# EAGLE design starfire-core (EAGLE 9.2.2)
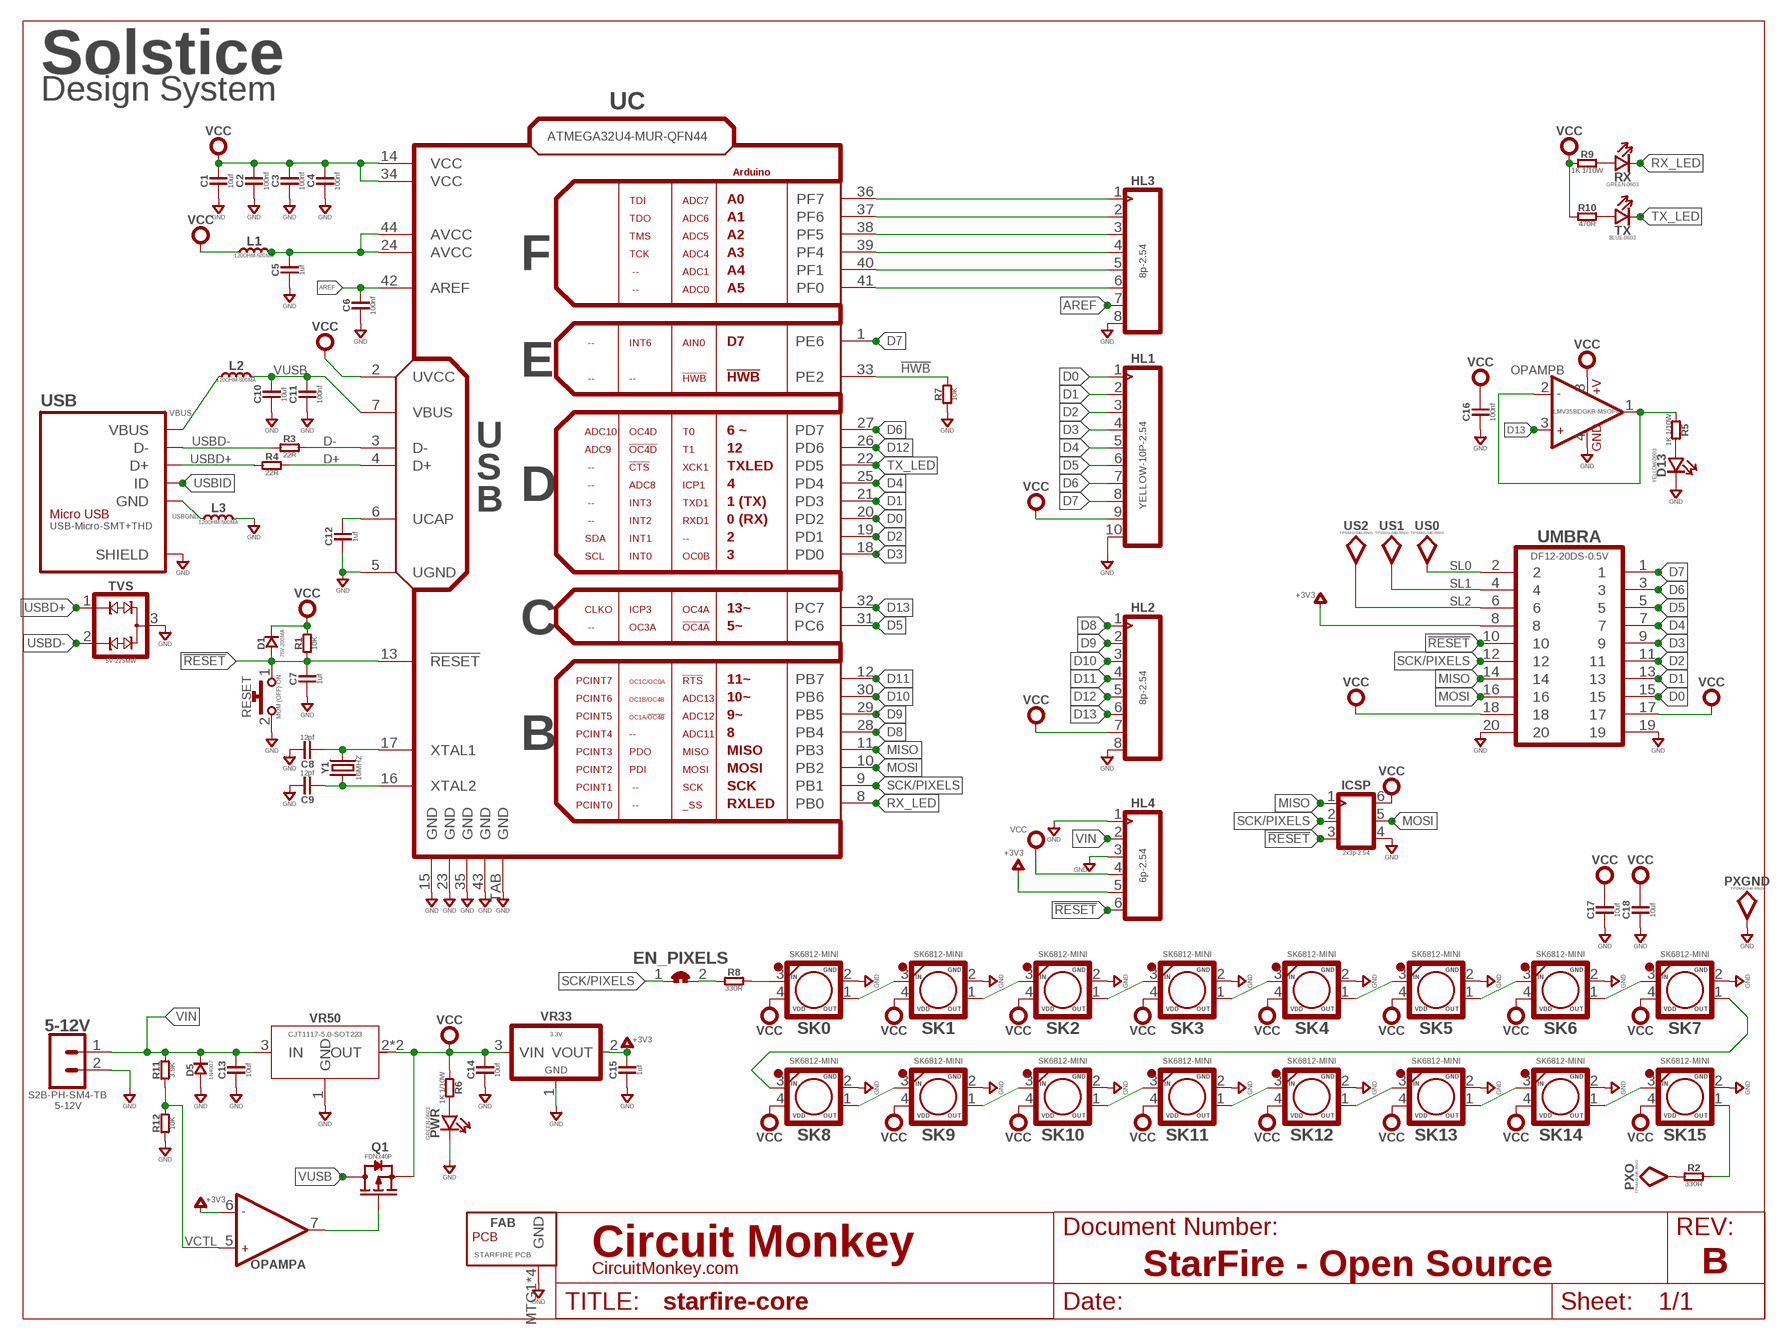
[diagram p0: schematic, sheet 1]
U$1 (LETTER_L-CIRCUITMONKEY): DOCUMENT_NUMBER: StarFire - Open Source; REV: B

## Parts
5-12V  S2B-PH-SM4-TB  02PRA-SMT  [S2B-PH-SM4-]
C1  10uf  CERAMIC-10UF-10V-10%-X5R(0603)  [C0603]
C2  100nf  CERAMIC-100NF-50V-10%-X7R(0603)  [C0603]
C3  100nf  CERAMIC-100NF-50V-10%-X7R(0603)  [C0603]
C4  100nf  CERAMIC-100NF-50V-10%-X7R(0603)  [C0603]
C5  1uf  CERAMIC-1UF-25V-10%-X7R(0603)  [C0603]
C6  100nf  CERAMIC-100NF-50V-10%-X7R(0603)  [C0603]
C7  1uf  CERAMIC-1UF-25V-10%-X7R(0603)  [C0603]
C8  12pf  CERAMIC-12PF-50V-5%-NPO(0603)  [C0603]
C9  12pf  CERAMIC-12PF-50V-5%-NPO(0603)  [C0603]
C10  10uf  CERAMIC-10UF-10V-10%-X5R(0603)  [C0603]
C11  100nf  CERAMIC-100NF-50V-10%-X7R(0603)  [C0603]
C12  1uf  CERAMIC-1UF-25V-10%-X7R(0603)  [C0603]
C13  10uf  CERAMIC-10UF-10V-10%-X5R(0603)  [C0603]
C14  10uf  CERAMIC-10UF-10V-10%-X5R(0603)  [C0603]
C15  1uf  CERAMIC-1UF-25V-10%-X7R(0603)  [C0603]
C16  100nf  CERAMIC-100NF-50V-10%-X7R(0603)  [C0603]
C17  10uf  CERAMIC-10UF-10V-10%-X5R(0603)  [C0603]
C18  10uf  CERAMIC-10UF-10V-10%-X5R(0603)  [C0603]
D1  75V-200MA  SMD-DIODE-SWITCHING-75V-200MA(LL-34)  [LL-34]
D5  1N4007  DIODE-GEN-PURPOSE-1KV-1A(DO-214AC)  [DO-214AC]
D13  YELLOW-0603  SMD-LED-CLEAR-YELLOW(0603)  [LED-0603]
EN_PIXELS  SOLDER_JUMPER-80MIL-RND  [SOLDER_JUMP_80MIL_RND]
FAB  STARFIRE PCB  PCB-4-MTG-BASE-B1  [PCB-BASE-B1]
HL1  YELLOW-10P-2.54  DIP-YELLOW-FEMALE-HEADER-VERT(10P-2.54)  [H10-2.54]
HL2  8p-2.54  DIP-BLACK-FEMALE-HEADER-VERT(8P-2.54)  [H8-2.54]
HL3  8p-2.54  DIP-BLACK-FEMALE-HEADER-VERT(8P-2.54)  [H8-2.54]
HL4  6p-2.54  DIP-BLACK-FEMALE-HEADER-VERT(6P-2.54)  [H6-2.54]
ICSP  2x3p-2.54  DIP-BLACK-MALE-HEADER(2X3P-2.54）-2.54  [H2X3-2.54]
L1  120OHM-500MA  SMD-FERRITE-CHIP-120-OHM-500MA(0603)  [L0603]
L2  120OHM-500MA  SMD-FERRITE-CHIP-120-OHM-500MA(0603)  [L0603]
L3  120OHM-500MA  SMD-FERRITE-CHIP-120-OHM-500MA(0603)  [L0603]
OPAMP  LMV358IDGKR-MSOP8  AMPLIFIER-LMV358IDGKR(MSOP8)  [MSOP8-0.65-3X3MM]
PWR  GREEN-0603  SMD-LED-CLEAR-GREEN(0603)  [LED-0603]
PXGND  TPSMD-040-RND  [SMD-040MIL-RND]
PXO  TPSMD-040-RND  [SMD-040MIL-RND]
Q1  FDN340P  SMD-MOSFET-P-CH-20V-2A-FDN340P(SOT-23)  [SOT-23]
R1  10K  SMD-RES-10K-1%-1/10W(0603)  [R0603]
R2  330R  SMD-RES-330R-1%-1/10W(0603)  [R0603]
R3  22R  SMD-RES-22R-5%-1/10W(0603)  [R0603]
R4  22R  SMD-RES-22R-5%-1/10W(0603)  [R0603]
R5  1K 1/10W  SMD-RES-1K-5%-1/10W(0603)  [R0603]
R6  1K 1/10W  SMD-RES-1K-5%-1/10W(0603)  [R0603]
R7  10K  SMD-RES-10K-1%-1/10W(0603)  [R0603]
R8  330R  SMD-RES-330R-1%-1/10W(0603)  [R0603]
R9  1K 1/10W  SMD-RES-1K-5%-1/10W(0603)  [R0603]
R10  470R  SMD-RES-470R-5%-1/10W(0603)  [R0603]
R11  3.9K  SMD-RES-3.9K-5%-1/10W(0603)  [R0603]
R12  10K  SMD-RES-10K-1%-1/10W(0603)  [R0603]
RESET  MOM (OFF)-ON  TACTILE-2PSMD  [SWITCH-0635-2P-SMD]
RX  GREEN-0603  SMD-LED-CLEAR-GREEN(0603)  [LED-0603]
SK0  SK6812-MINI  SK6812MINI  [SMD_3535]
SK1  SK6812-MINI  SK6812MINI  [SMD_3535]
SK2  SK6812-MINI  SK6812MINI  [SMD_3535]
SK3  SK6812-MINI  SK6812MINI  [SMD_3535]
SK4  SK6812-MINI  SK6812MINI  [SMD_3535]
SK5  SK6812-MINI  SK6812MINI  [SMD_3535]
SK6  SK6812-MINI  SK6812MINI  [SMD_3535]
SK7  SK6812-MINI  SK6812MINI  [SMD_3535]
SK8  SK6812-MINI  SK6812MINI  [SMD_3535]
SK9  SK6812-MINI  SK6812MINI  [SMD_3535]
SK10  SK6812-MINI  SK6812MINI  [SMD_3535]
SK11  SK6812-MINI  SK6812MINI  [SMD_3535]
SK12  SK6812-MINI  SK6812MINI  [SMD_3535]
SK13  SK6812-MINI  SK6812MINI  [SMD_3535]
SK14  SK6812-MINI  SK6812MINI  [SMD_3535]
SK15  SK6812-MINI  SK6812MINI  [SMD_3535]
TVS  5V-225MW  SMD-DIODE-TVS-5V-225MW(SOT-23)  [SOT-23]
TX  BLUE-0603  SMD-LED-CLEAR-BLUE(0603)  [LED-0603]
UC  ATMEGA32U4-MUR-QFN44  MCU-ATMEGA32U4-MUR(VQFN44)  [QFN44G-0.5-7X7MM]
UMBRA  DF12-20DS-0.5V  DF12-20P-RCPT  [DF12-20P-RCPT-MTL-BOSS]
US0  TPSMD-040-RND  [SMD-040MIL-RND]
US1  TPSMD-040-RND  [SMD-040MIL-RND]
US2  TPSMD-040-RND  [SMD-040MIL-RND]
USB  USB-Micro-SMT+THD  MICRO-USB-SMD(ZX62-B-5PA)  [MICRO-USB5+6P-SMD-0.65-AB]
VR33  3.3V  PMIC-LDO-XC6206P332MR-G(SOT23)  [SOT-23]
VR50  CJT1117-5.0-SOT223  PMIC-CJT1117-5.0(SOT223)  [SOT-223]
Y1  16MHZ  SMD-CRYSTAL-16MHZ-8PF-20PPM-40R(2P-5.0X3.2MM)  [X2-SMD-5.0X3.2X1.3MM]

## Nets
!HWB: R7.2 UC.33(PE2)
!RESET: C7.2 D1.A(+) HL4.6 ICSP.3 R1.1 RESET.1 UC.13(!RESET) UMBRA.10
+3V3: C15.2 HL4.5 OPAMP.6(A:-IN2) UMBRA.8 VR33.2(VOUT)
AREF: C6.2 HL3.7 UC.42(AREF)
AVCC: C5.2 L1.2 UC.24(AVCC) UC.44(AVCC)
D0: HL1.1 UC.20(PD2) UMBRA.15
D1: HL1.2 UC.21(PD3) UMBRA.13
D2: HL1.3 UC.19(PD1) UMBRA.11
D3: HL1.4 UC.18(PD0) UMBRA.9
D4: HL1.5 UC.25(PD4) UMBRA.7
D5: HL1.6 UC.31(PC6) UMBRA.5
D6: HL1.7 UC.27(PD7) UMBRA.3
D7: HL1.8 UC.1(PE6) UMBRA.1
D8: HL2.1 UC.28(PB4)
D9: HL2.2 UC.29(PB5)
D10: HL2.3 UC.30(PB6)
D11: HL2.4 UC.12(PB7)
D12: HL2.5 UC.26(PD6)
D13: HL2.6 OPAMP.3(B:+IN1) UC.32(PC7)
D+: R4.2 UC.4(D+)
D-: R3.2 UC.3(D-)
GND: 5-12V.2 C1.1 C2.1 C3.1 C4.1 C5.1 C6.1 C7.1 C8.2 C9.2 C10.1 C11.1 C12.1 C13.1 C14.1 C15.1 C16.1 C17.1 C18.1 D5.1(+) D13.- FAB.MTG1(GND) FAB.MTG2(GND) FAB.MTG3(GND) FAB.MTG4(GND) HL1.10 HL2.8 HL3.8 HL4.1 HL4.3 ICSP.4 L3.2 OPAMP.4(B:GND) PWR.- PXGND.TP R7.1 R12.1 RESET.2 SK0.2(GND) SK1.2(GND) SK2.2(GND) SK3.2(GND) SK4.2(GND) SK5.2(GND) SK6.2(GND) SK7.2(GND) SK8.2(GND) SK9.2(GND) SK10.2(GND) SK11.2(GND) SK12.2(GND) SK13.2(GND) SK14.2(GND) SK15.2(GND) TVS.3 UC.5(UGND) UC.15(GND) UC.23(GND) UC.35(GND) UC.43(GND) UC.TAB(GND) UMBRA.19 UMBRA.20 USB.P1(SHIELD) USB.P2(SHIELD) USB.P3_1(SHIELD) USB.P3_2(SHIELD) USB.P3_3(SHIELD) USB.P4_1(SHIELD) USB.P4_2(SHIELD) USB.P4_3(SHIELD) USB.P5(SHIELD) USB.P6(SHIELD) VR33.1(VSS) VR50.1(GND)
MISO: ICSP.1 UC.11(PB3) UMBRA.14
MOSI: ICSP.5 UC.10(PB2) UMBRA.16
N$1: SK0.1(OUT) SK1.3(IN)
N$2: C8.1 UC.17(XTAL1) Y1.2
N$3: C9.1 UC.16(XTAL2) Y1.1
N$4: SK1.1(OUT) SK2.3(IN)
N$5: SK2.1(OUT) SK3.3(IN)
N$6: SK3.1(OUT) SK4.3(IN)
N$7: HL3.1 UC.36(PF7)
N$8: D13.+ R5.2
N$9: SK4.1(OUT) SK5.3(IN)
N$10: PWR.+ R6.2
N$11: SK5.1(OUT) SK6.3(IN)
N$12: SK6.1(OUT) SK7.3(IN)
N$13: SK8.1(OUT) SK9.3(IN)
N$14: R8.2 SK0.3(IN)
N$15: SK9.1(OUT) SK10.3(IN)
N$16: SK10.1(OUT) SK11.3(IN)
N$17: SK11.1(OUT) SK12.3(IN)
N$18: SK12.1(OUT) SK13.3(IN)
N$19: SK13.1(OUT) SK14.3(IN)
N$20: SK14.1(OUT) SK15.3(IN)
N$21: R10.2 TX.+
N$22: R9.2 RX.+
N$23: HL3.2 UC.37(PF6)
N$24: HL3.3 UC.38(PF5)
N$25: HL3.4 UC.39(PF4)
N$26: HL3.5 UC.40(PF1)
N$27: HL3.6 UC.41(PF0)
N$28: SK7.1(OUT) SK8.3(IN)
N$29: PXO.TP R2.1
N$30: R2.2 SK15.1(OUT)
N$34: OPAMP.1(B:OUT1) OPAMP.2(B:-IN1) R5.1
N$35: OPAMP.7(A:OUT2) Q1.1(G)
PIXELS: EN_PIXELS.2 R8.1
RX_LED: RX.- UC.8(PB0)
SCK/PIXELS: EN_PIXELS.1 ICSP.2 UC.9(PB1) UMBRA.12
SL0: UMBRA.2 US0.TP
SL1: UMBRA.4 US1.TP
SL2: UMBRA.6 US2.TP
TX_LED: TX.- UC.22(PD5)
UCAP: C12.2 UC.6(UCAP)
USBD+: R4.1 TVS.1 USB.3(D+)
USBD-: R3.1 TVS.2 USB.2(D-)
USBGND: L3.1 USB.5(GND)
USBID: USB.4(ID)
VBUS: L2.1 USB.1(VBUS)
VCC: C1.2 C2.2 C3.2 C4.2 C14.2 C16.2 C17.2 C18.2 D1.C(-) HL1.9 HL2.7 HL4.4 ICSP.6 L1.1 OPAMP.8(B:+V) Q1.2(S) R1.2 R6.1 R9.1 R10.1 SK0.4(VDD) SK1.4(VDD) SK2.4(VDD) SK3.4(VDD) SK4.4(VDD) SK5.4(VDD) SK6.4(VDD) SK7.4(VDD) SK8.4(VDD) SK9.4(VDD) SK10.4(VDD) SK11.4(VDD) SK12.4(VDD) SK13.4(VDD) SK14.4(VDD) SK15.4(VDD) UC.2(UVCC) UC.14(VCC) UC.34(VCC) UMBRA.17 UMBRA.18 VR33.3(VIN) VR50.2(OUT) VR50.TER(OUT)
VCTL: OPAMP.5(A:+IN2) R11.1 R12.2
VIN: 5-12V.1 C13.2 D5.2(-) HL4.2 R11.2 VR50.3(IN)
VUSB: C10.2 C11.2 L2.2 Q1.3(D) UC.7(VBUS)

## Notes on the sheet
- Solstice
- Design System
- 5-12V

## Library data of the parts
5-12V = con-jst:02P: 2 pin connector
C1 C10 C13 C14 C17 C18 = Seeed-Capacitor:CERAMIC-10UF-10V-10%-X5R(0603): 302010103; MPN: CC0603KRX5R6BB106
C2-C4 C6 C11 C16 = Seeed-Capacitor:CERAMIC-100NF-50V-10%-X7R(0603): 302010138; MPN: CC0603KRX7R9BB104
C5 C7 C12 C15 = Seeed-Capacitor:CERAMIC-1UF-25V-10%-X7R(0603): 302010139; MPN: CC0603KRX7R8BB105
C8 C9 = Seeed-Capacitor:CERAMIC-12PF-50V-5%-NPO(0603): 302010067; MPN: CC0603JRNPO9BN120
D1 = Seeed-Diode:SMD-DIODE-SWITCHING-75V-200MA(LL-34): 304040011; MPN: LL4148ST
D5 = Seeed-Diode:DIODE-GEN-PURPOSE-1KV-1A(DO-214AC): 304010013; MPN: 1N4007
D13 = Seeed-LED:SMD-LED-CLEAR-YELLOW(0603): 304090044; MPN: 19-217-Y5C-AM1N1VY-3T
EN_PIXELS = rlc:SOLDER_JUMPER
FAB = solstice-design-system:PCB-4-MTG: PCBs with 4 mounting holes
HL1 = Seeed-Connector:DIP-YELLOW-FEMALE-HEADER-VERT(10P-2.54): 320030059; MPN: F185-1110A1BSYC1
HL2 HL3 = Seeed-Connector:DIP-BLACK-FEMALE-HEADER-VERT(8P-2.54): 320030061; MPN: F185-1108A1BSYC1
HL4 = Seeed-Connector:DIP-BLACK-FEMALE-HEADER-VERT(6P-2.54): 320030060; MPN: F185-1106A1BSYC1
ICSP = Seeed-Connector:DIP-BLACK-MALE-HEADER(2X3P-2.54）: 320020077; MPN: P125-12A1BS116A1
L1-L3 = Seeed-Inductor:SMD-FERRITE-CHIP-120-OHM-500MA(0603): 303030001; MPN: BLM18AG121SN1D
OPAMP = Seeed-IC:AMPLIFIER-LMV358IDGKR(MSOP8): 310020007; MPN: LMV358IDGKR
PWR RX = Seeed-LED:SMD-LED-CLEAR-GREEN(0603): 304090043; MPN: 19-217-G7C-AN1P2-3T
PXGND PXO US0 US1 US2 = con-testpoints:TP: Test Point -- Testpoint
Q1 = Seeed-Transistor:SMD-MOSFET-P-CH-20V-2A-FDN340P(SOT-23): 305030026; MPN: FDN340P
R1 R7 R12 = Seeed-Resistor:SMD-RES-10K-1%-1/10W(0603): 301010299; MPN: RC0603FR-0710KL
R2 R8 = Seeed-Resistor:SMD-RES-330R-1%-1/10W(0603): 301010300; MPN: RC0603FR-07330RL
R3 R4 = Seeed-Resistor:SMD-RES-22R-5%-1/10W(0603): 301010289; MPN: RC0603JR-0722RL
R5 R6 R9 = Seeed-Resistor:SMD-RES-1K-5%-1/10W(0603): 301010291; MPN: RC0603JR-071KL
R10 = Seeed-Resistor:SMD-RES-470R-5%-1/10W(0603): 301010088; MPN: RC0603JR-07470RL
R11 = Seeed-Resistor:SMD-RES-3.9K-5%-1/10W(0603): 301010101; MPN: RC0603JR-073K9L
RESET = comp-switch:TACTILE-2P: Pushbutton Switch, 2 pin, SPST, PCB Mount, THD; MFR: CK Switch; MPN: PTS635S*SMTR; MPN2: Pololu #1400
SK0 SK1-SK15 = led:SK6812: SK6812; MFR: CHINA
TVS = Seeed-Diode:SMD-DIODE-TVS-5V-225MW(SOT-23): 304050003; MPN: CESD5V0AP
TX = Seeed-LED:SMD-LED-CLEAR-BLUE(0603): 304090045; MPN: 19-217-BHC-ZL1M2RY-3T
UC = Seeed-IC:MCU-ATMEGA32U4-MUR(VQFN44): 310010016; MPN: ATMEGA32U4-MUR
UMBRA = co-hirose:DF12-20P: DF12 20-pin
USB = Seeed-Connector:MICRO-USB-SMD(ZX62-B-5PA): 320010005; MPN: ZX62-B-5PA8
VR33 = Seeed-IC:PMIC-LDO-XC6206P332MR-G(SOT23): 310030099; MPN: XC6206P332MR-G; MPN2: AP2120N-3.3
VR50 = Seeed-IC:PMIC-CJT1117-5.0(SOT223): 310030096; MPN: CJT1117-5.0
Y1 = Seeed-Crystal Oscillator:SMD-CRYSTAL-16MHZ-8PF-20PPM-40R(2P-5.0X3.2MM): 306010054; MPN: X053201602002

## Board
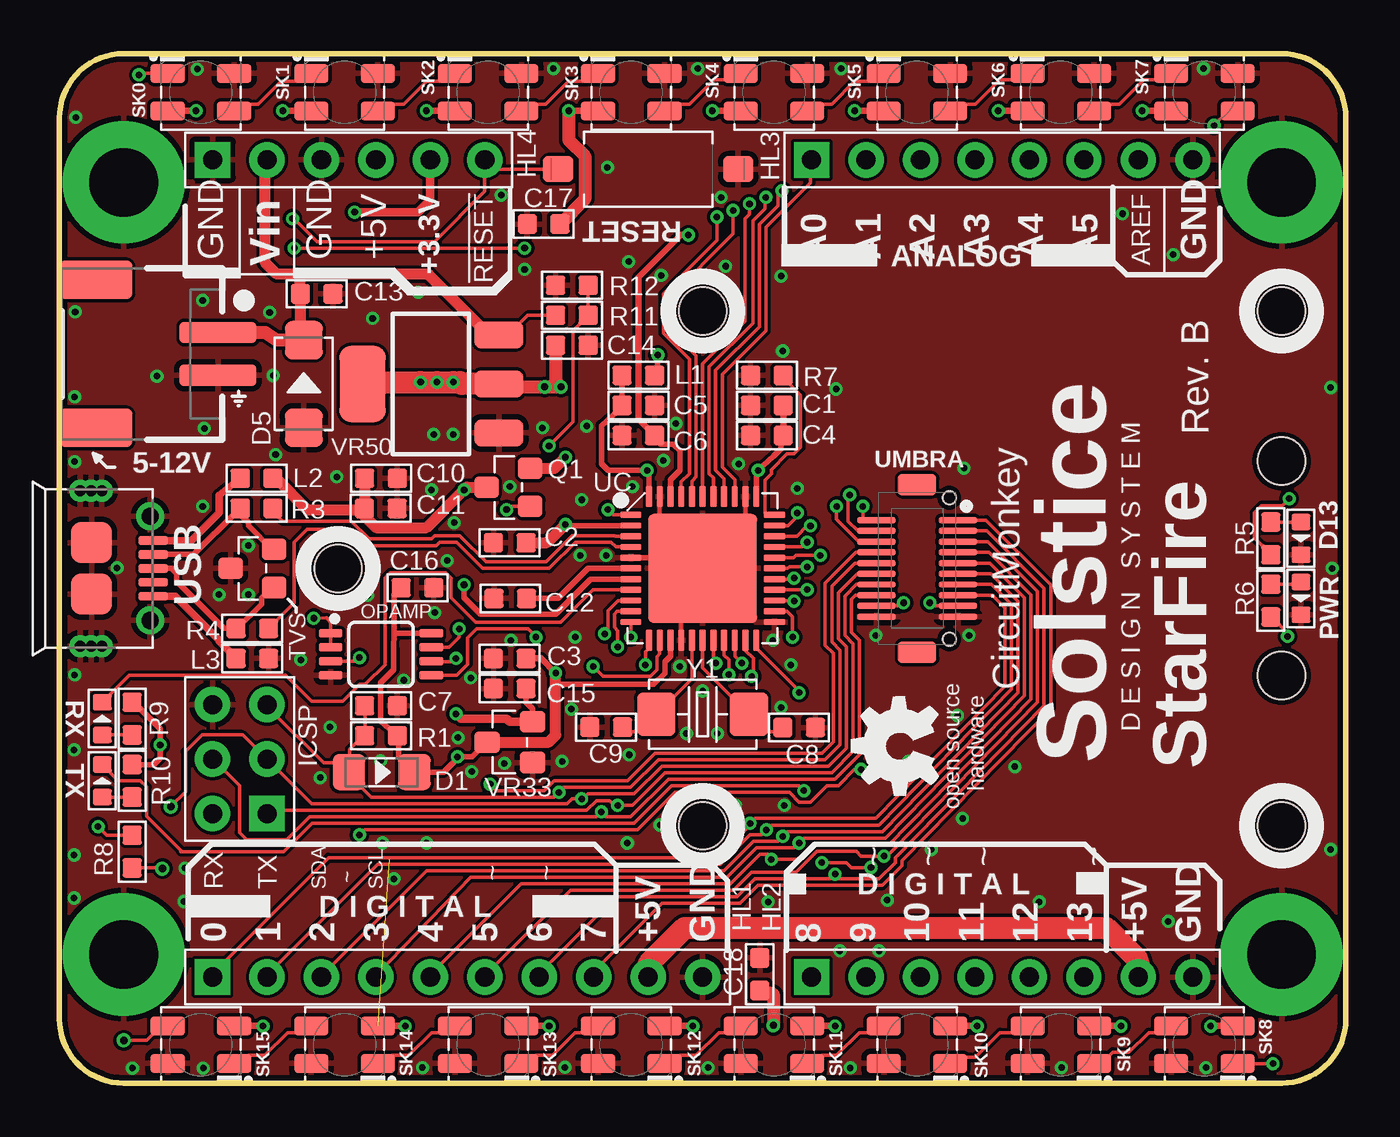
[diagram p1: board, top side]
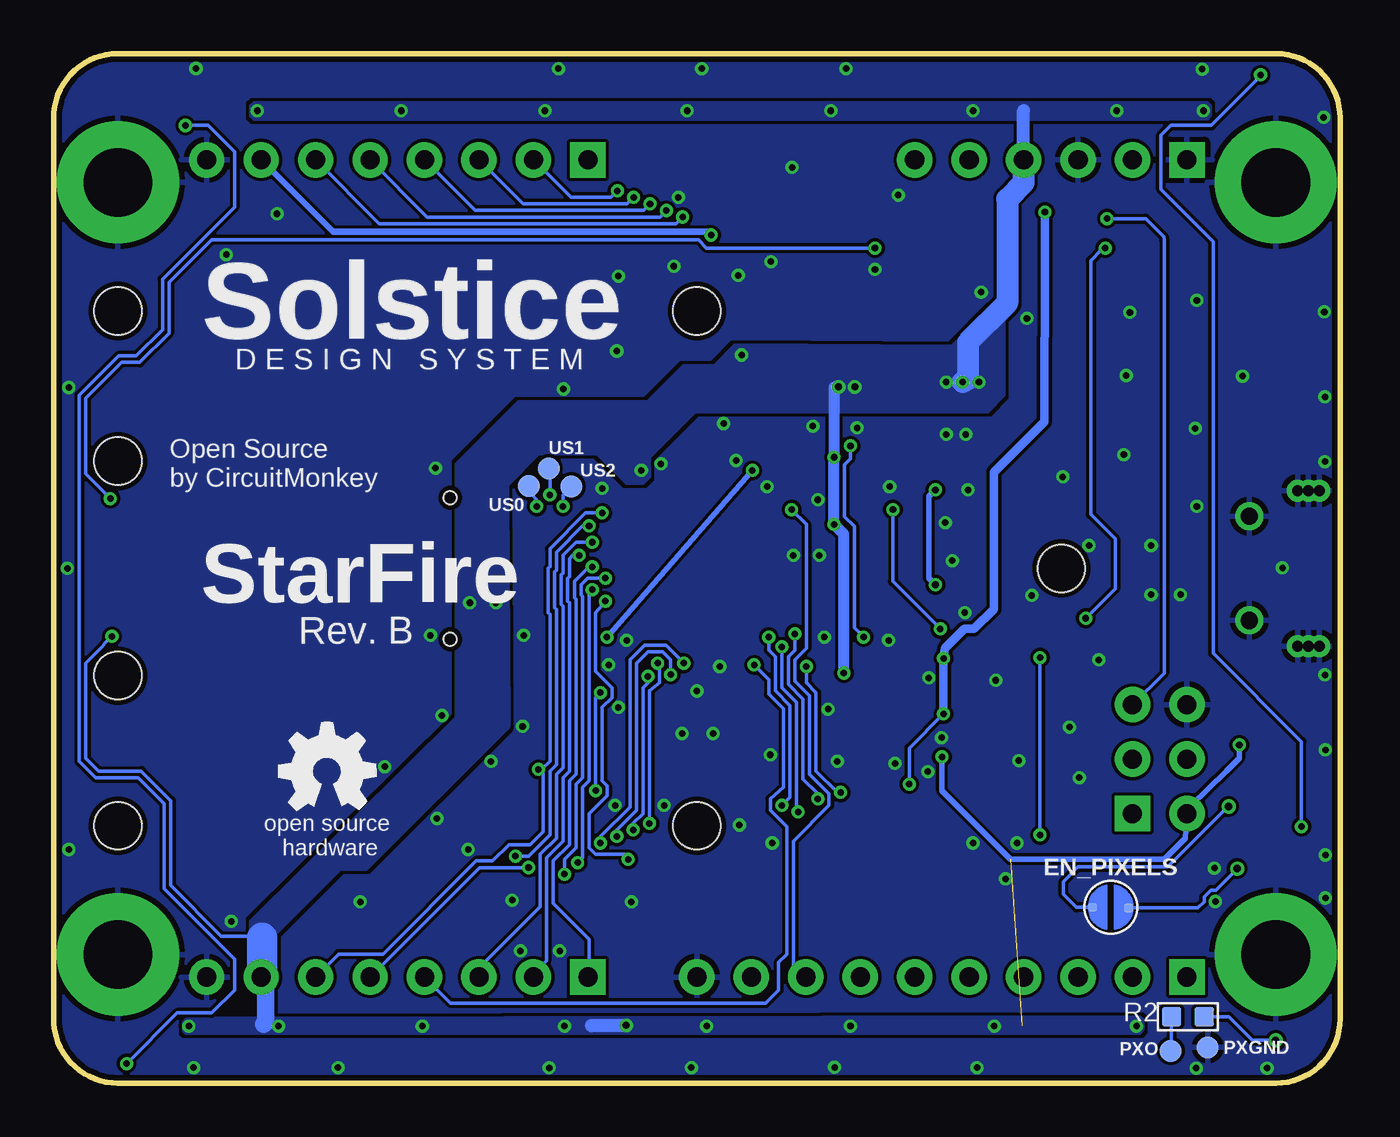
[diagram p2: board, bottom side, seen from below]

Size 60 x 48 mm. Coordinates in mm from the lower left corner, seen from the top.
Outline: 3,0 57,0 arc90 60,3 60,45 arc90 57,48 3,48 arc90 0,45 0,3 arc90 3,0
Copper layers (1*16): Top 0.035mm / dielectric 1.5mm / Bottom 0.035mm
Design rules "SeeedStudio_2layer_2018_marks": minimum track width 6mil, minimum drill 12mil, track to track 6mil, track to pad 6mil, pad to pad 6mil, via to via 6mil, smd to smd 0mil, copper to edge 10mil, drill to drill 10mil, minimum pad ring 10mil, minimum via ring 6mil, stop-mask expansion 2mil, vias tented up to drill 100mil, thermal gap 10mil
Holes 2.2 mm at 57,29 57,19 13,24

### Footprints (pad centres in the part's own frame; a part is rotated, then mirrored left to right if it is on the bottom)
S2B-PH-SM4- = smd 1 x 3.6: 1 1,-7.3; 2 -1,-7.3 | smd 1.8 x 3.4: GND@MT1 3.45,-1.6; GND@MT2 -3.45,-1.6
C0603 = smd 0.889 x 0.889: 1 0,0.762; 2 0,-0.762
LL-34 = smd 1.524 x 1.676: A -1.524,0; C 1.524,0
DO-214AC = smd 1.8 x 1.77: 1 -2.042,0; 2 2.042,0
LED-0603 = smd 0.762 x 0.889: + -0.762,0; - 0.762,0
SOLDER_JUMP_80MIL_RND = smd 0.406 x 0.406: 1 -0.838,0; 2 0.838,-0.025
PCB-BASE-B1 = drill 3.2 pad 5.7: MTG1 -27,-18; MTG2 -27,18; MTG3 27,18; MTG4 27,-18 | hole 2.2: 0,-12; 0,12; 27,12; 27,-12
H10-2.54 = drill 0.889 pad 1.651 square: 1 0,11.43 | drill 0.889 pad 1.651: 2 0,8.89; 3 0,6.35; 4 0,3.81; 5 0,1.27; 6 0,-1.27; 7 0,-3.81; 8 0,-6.35; 9 0,-8.89; 10 0,-11.43
H8-2.54 = drill 0.889 pad 1.651 square: 1 0,8.89 | drill 0.889 pad 1.651: 2 0,6.35; 3 0,3.81; 4 0,1.27; 5 0,-1.27; 6 0,-3.81; 7 0,-6.35; 8 0,-8.89
H6-2.54 = drill 0.889 pad 1.651 square: 1 0,6.35 | drill 0.889 pad 1.651: 2 0,3.81; 3 0,1.27; 4 0,-1.27; 5 0,-3.81; 6 0,-6.35
H2X3-2.54 = drill 0.889 pad 1.651 square: 1 -1.27,2.54 | drill 0.889 pad 1.651: 2 -1.27,0; 3 -1.27,-2.54; 4 1.27,-2.54; 5 1.27,0; 6 1.27,2.54
L0603 = smd 0.889 x 0.889: 1 -0.762,0; 2 0.762,0
MSOP8-0.65-3X3MM = smd 1.1 x 0.4: 1 -2.35,0.975; 2 -2.35,0.325; 3 -2.35,-0.325; 4 -2.35,-0.975; 5 2.35,-0.975; 6 2.35,-0.325; 7 2.35,0.325; 8 2.35,0.975
SMD-040MIL-RND = smd 1.016 x 1.016: TP 0,0
SOT-23 = smd 1.016 x 1.143: 1 -0.889,-1.016; 2 0.889,-1.016; 3 0,1.016
R0603 = smd 0.889 x 0.889: 1 0,0.762; 2 0,-0.762
SWITCH-0635-2P-SMD = smd 1.4 x 1.2: 1 -4.2,0; 2 4.2,0
SMD_3535 = smd 1.6 x 0.9: 1 -1.55,0.875; 2 -1.55,-0.875; 3 1.55,-0.875; 4 1.55,0.875
QFN44G-0.5-7X7MM = smd 1 x 0.3: 1 -3.35,2.5; 2 -3.35,2; 3 -3.35,1.5; 4 -3.35,1; 5 -3.35,0.5; 6 -3.35,0; 7 -3.35,-0.5; 8 -3.35,-1; 9 -3.35,-1.5; 10 -3.35,-2; 11 -3.35,-2.5; 23 3.35,-2.5; 24 3.35,-2; 25 3.35,-1.5; 26 3.35,-1; 27 3.35,-0.5; 28 3.35,0; 29 3.35,0.5; 30 3.35,1; 31 3.35,1.5; 32 3.35,2; 33 3.35,2.5 | smd 0.3 x 1: 12 -2.5,-3.35; 13 -2,-3.35; 14 -1.5,-3.35; 15 -1,-3.35; 16 -0.5,-3.35; 17 0,-3.35; 18 0.5,-3.35; 19 1,-3.35; 20 1.5,-3.35; 21 2,-3.35; 22 2.5,-3.35; 34 2.5,3.35; 35 2,3.35; 36 1.5,3.35; 37 1,3.35; 38 0.5,3.35; 39 0,3.35; 40 -0.5,3.35; 41 -1,3.35; 42 -1.5,3.35; 43 -2,3.35; 44 -2.5,3.35 | smd 5.08 x 5.08: TAB 0,0
DF12-20P-RCPT-MTL-BOSS = smd 0.3 x 1.8: 1 -2.25,1.9; 2 -2.25,-1.9; 3 -1.75,1.9; 4 -1.75,-1.9; 5 -1.25,1.9; 6 -1.25,-1.9; 7 -0.75,1.9; 8 -0.75,-1.9; 9 -0.25,1.9; 10 -0.25,-1.9; 11 0.25,1.9; 12 0.25,-1.9; 13 0.75,1.9; 14 0.75,-1.9; 15 1.25,1.9; 16 1.25,-1.9; 17 1.75,1.9; 18 1.75,-1.9; 19 2.25,1.9; 20 2.25,-1.9 | smd 1 x 1.8: MT1 -3.9,0; MT2 3.9,0 | hole 0.6: -3.3,1.5; 3.3,1.5
MICRO-USB5+6P-SMD-0.65-AB = smd 0.4 x 1.35: 1 -1.3,2.875; 2 -0.65,2.875; 3 0,2.875; 4 0.65,2.875; 5 1.3,2.875 | smd 1.9 x 1.9: P1 -1.2,0; P2 1.2,0 | drill 0.508 pad 1.016: P3_1 -3.625,-0.533; P3_2 -3.625,-0.025; P3_3 -3.625,0.483; P4_1 3.625,-0.533; P4_2 3.625,-0.025; P4_3 3.625,0.483 | drill 0.8: P5 -2.425,2.73; P6 2.425,2.73
SOT-23' = smd 1.016 x 1.2: 1 -0.95,-1.06; 2 0.95,-1.06; 3 0,1.06
SOT-223 = smd 1.27 x 2.286: 1 -2.286,-3.175; 2 0,-3.175; 3 2.286,-3.175 | smd 3.556 x 2.159: TER 0,3.175
X2-SMD-5.0X3.2X1.3MM = smd 1.778 x 2.032: 1 -2.159,0; 2 2.159,0

### Placement (x,y rotation side)
5-12V  0.1,34 90 top
C1  33,31.6 90 top
C2  21,25.2 90 top
C3  21,19.8 90 top
C4  33,30.2 90 top
C5  27,31.6 270 top
C6  27,30.2 90 top
C7  15,17.6 270 top
C8  34.5,16.58 90 top
C9  25.5,16.6 270 top
C10  15,28.2 270 top
C11  14.99,26.8 270 top
C12  21.03,22.6 90 top
C13  12,36.8 270 top
C14  23.9,34.4 270 top
C15  21,18.4 90 top
C16  16.7,23.1 270 top
C17  22.58,40.06 90 top
C18  32.66,5.08 0 top
D1  15.03,14.5 0 top
D5  11.4,32.6 90 top
D13  57.9,25.4 270 top
EN_PIXELS  10.7,8.2 0 bottom
FAB  30,24 0 top
HL1  18.57,4.95 90 top
HL2  43.97,4.95 90 top
HL3  43.97,43.05 90 top
HL4  13.49,43.05 90 top
ICSP  8.41,15.11 180 top
L1  27,33 180 top
L2  9.2,28.2 0 top
L3  9,19.8 0 top
OPAMP  15,20 0 top
PWR  57.9,22.6 270 top
PXGND  6.18,1.67 0 bottom
PXO  7.9,1.51 0 bottom
Q1  20.94,27.78 90 top
R1  15,16.2 90 top
R2  7.1,3.1 90 bottom
R3  9.2,26.8 90 top
R4  9,21.2 90 top
R5  56.5,25.4 180 top
R6  56.5,22.5 180 top
R7  33,33 90 top
R8  3.4,10.8 180 top
R9  3.4,17 0 top
R10  3.4,14.1 0 top
R11  23.9,35.8 270 top
R12  23.9,37.2 90 top
RESET  27.46,42.62 0 top
RX  2,17 90 top
SK0  6.6,46.2 180 top
SK1  13.3,46.2 180 top
SK2  20,46.2 180 top
SK3  26.67,46.2 180 top
SK4  33.33,46.2 180 top
SK5  40,46.2 180 top
SK6  46.7,46.2 180 top
SK7  53.4,46.2 180 top
SK8  53.4,1.8 0 top
SK9  46.7,1.8 0 top
SK10  40,1.8 0 top
SK11  33.33,1.8 0 top
SK12  26.67,1.8 0 top
SK13  20,1.8 0 top
SK14  13.3,1.8 0 top
SK15  6.6,1.8 0 top
TVS  9,24 90 top
TX  2,14.1 90 top
U$2  [OSHW_5MM]  39.2,15.72 90 top
U$3  [OSHW_5MM]  47.25,14.54 0 bottom
UC  30,24 0 top
UMBRA  40,24 270 top
US0  37.83,27.84 0 bottom
US1  36.91,28.67 0 bottom
US2  35.85,27.82 0 bottom
USB  1.5,24 270 top
VR33  3.3V  [SOT-23']  21,15.9 90 top
VR50  17.32,32.6 90 top
Y1  30,17.2 0 top

### Tracks (layer width: path | path; a pad name or v marks a point on that pad's centre or on a via)
!HWB
  Top 0.152: R7.2 33.79,32.86 34.57,32.08 34.57,29.64 34.27,29.33 33.94,29.33 33.2,28.6 33.2,28.42 32.9,28.11 32.9,26.59 33.05,26.44 33.41,26.44 UC.33
!RESET  (via drill 0.3)
  Top 0.152: UC.13 28,20.02 27.87,19.89 27.87,19.28 27.56,18.97 25.35,18.97 v24.89,19.43 | D1.A 13.54,14.32 14.53,13.33 23.07,13.33 v23.29,13.56 23.52,13.79 26.65,13.79 27.94,15.09 35.72,15.09 36.4,15.77 36.4,20.19 36.02,20.57 36.02,23.16 37.11,24.25 UMBRA.10 | C7.2 14.25,17.02 R1.1 14.16,16.2 13.54,15.58 13.54,15.24 D1.A | ICSP.3 9.77,17.71 9.77,17.48 12.32,14.93 13.07,14.93 D1.A | RESET.1 20.22,42.62 19.79,43.05 HL4.6 19.84,41.58 17.5,39.24 12.02,39.24 10.95,40.31 v10.87,40.31
  Bottom 0.152: v24.89,19.43 24.89,18.67 24.44,18.21 24.44,14.55 23.45,13.56 v23.29,13.56 | v10.87,40.31 9.06,40.31 8.23,39.47 8.21,39.32 8.21,19.12 ICSP.3
+3V3  (via drill 0.3)
  Top 0.152: OPAMP.6 17.38,19.66 18.34,19.66 v18.49,19.81 | UMBRA.8 37.15,24.75 35.72,23.31 35.72,20.42 36.1,20.04 36.1,15.92 35.56,15.39 27.79,15.39 26.5,14.09 23.07,14.09 22.61,13.64 20.4,13.64 v20.09,13.94
  Top 0.254: C15.2 21.77,17.75 22.06,17.46 VR33.2
  Top 0.406: v18.49,17.22 18.72,16.99 20.86,16.99 21,16.85 VR33.2 | v13.77,40.61 16.74,40.61 17.3,41.17 HL4.5
  Bottom 0.152: v20.09,13.94 20.09,15.62 v18.49,17.22
  Bottom 0.406: v18.49,17.22 v18.49,19.81 18.43,20.27 17.51,21.18 17.07,21.18 16.15,22.1 16.15,28.48 13.79,30.84 13.79,34.71 13.77,34.84 v13.77,40.61
AREF  (via drill 0.3)
  Top 0.254: UC.42 28.5,28.14 28.93,28.57 28.93,29.49 28.63,29.79 28.04,29.8 C6.2
  Top 0.305: v29.34,39.55 28.98,39.55 27,37.56 27,30.96 C6.2
  Bottom 0.305: HL3.7 46.97,39.7 29.49,39.7 v29.34,39.55
AVCC  (via drill 0.3)
  Top 0.152: UC.24 33.94,22 34.19,21.75 v34.19,20.8
  Top 0.254: UC.44 27.5,28.48 v27.41,28.57 25.58,28.57 25.28,28.88 25.28,30.65 26.24,31.52 | L1.2 C5.2
  Top 0.305: C5.2 26.24,31.52
  Bottom 0.254: v34.19,20.8 v27.41,28.57
D0  (via drill 0.3)
  Top 0.152: UC.20 31.5,19.91 v31.83,19.58 | HL1.1 7.14,5.1 12.55,10.51 30.69,10.51 32.21,12.04 32.13,12.04 v32.21,12.11 32.44,12.34 38.08,12.34 44.1,18.51 44.1,22.17 43.52,22.75 UMBRA.15
  Bottom 0.152: v31.83,19.58 31.75,19.5 31.75,18.67 32.21,18.29 v32.21,12.11
D1  (via drill 0.3)
  Top 0.152: UC.21 32,20.17 32.36,19.81 32.36,19.05 v32.29,18.97 | HL1.2 9.68,5.05 14.84,10.21 30.84,10.21 32.21,11.58 32.74,11.58 v32.97,11.81 33.2,12.04 38.23,12.04 44.4,18.36 44.4,22.32 43.48,23.25 UMBRA.13
  Bottom 0.152: v32.29,18.97 32.29,18.67 32.52,18.44 32.52,12.57 32.97,12.11 v32.97,11.81
D2  (via drill 0.3)
  Top 0.152: UC.19 31,19.95 31.22,19.73 v31.22,19.05 | HL1.3 12.22,5 17.12,9.9 30.99,9.9 32.36,11.28 33.51,11.28 v33.73,11.5 33.96,11.73 38.38,11.73 44.71,18.21 44.71,22.48 43.43,23.75 UMBRA.11
  Bottom 0.152: v31.22,19.05 31.22,19.73 31.6,20.11 32.29,20.11 32.82,19.58 32.82,12.72 33.73,11.81 v33.73,11.5
D3  (via drill 0.3)
  Top 0.152: UC.18 30.5,19.69 v30.61,19.58 | HL1.4 14.76,5.03 19.18,9.6 31.14,9.6 32.52,10.97 34.27,10.97 v34.5,11.2 34.72,11.43 38.53,11.43 45.01,18.06 45.01,22.63 43.39,24.25 UMBRA.9
  Bottom 0.152: v30.61,19.58 31.45,20.42 32.44,20.42 33.12,19.73 33.12,12.88 34.5,11.5 v34.5,11.2
D4  (via drill 0.3)
  Top 0.152: UC.25 34.32,22.5 v34.27,22.48 | HL1.5 17.3,5.05 21.54,9.29 31.3,9.29 32.67,10.66 33.05,10.66 v33.2,10.44 34.5,10.44 35.18,11.12 38.69,11.12 45.32,17.9 45.32,22.78 43.35,24.75 UMBRA.7
  Bottom 0.152: v34.27,22.48 34.72,21.94 34.72,19.2 33.96,18.44 33.96,17.98 34.42,17.52 34.42,14.09 34.19,13.87 34.19,13.41 35.03,12.57 35.03,10.97 34.72,10.66 33.35,10.66 v33.2,10.44
D5  (via drill 0.3)
  Top 0.152: UC.31 34.4,25.5 34.88,25.98 v35.03,25.98 | HL1.6 19.84,5 23.83,8.99 31.45,8.99 32.29,9.83 34.34,9.83 35.33,10.82 37.16,10.82 37.39,10.59 v38.46,10.59 38.61,10.59 38.84,10.82 45.62,17.75 45.62,22.93 43.3,25.25 UMBRA.5
  Bottom 0.152: v35.03,25.98 35.33,25.98 36.55,24.76 36.55,23.92 36.63,23.85 36.63,22.17 36.55,22.09 36.55,14.86 36.86,14.55 36.86,11.58 37.85,10.59 v38.46,10.59
D6  (via drill 0.3)
  Top 0.152: UC.27 34.16,23.5 v34.27,23.54 | HL1.7 22.38,5.1 25.96,8.68 31.6,8.68 32.44,9.52 35.94,9.52 v36.17,9.75 36.33,9.52 38.23,9.52 38.99,10.28 38.99,10.51 45.93,17.6 45.93,23.09 43.26,25.75 UMBRA.3
  Bottom 0.152: v34.27,23.54 35.1,23.54 35.41,23.24 35.41,22.78 35.33,22.7 35.33,14.25 35.64,13.94 35.64,10.97 36.17,10.44 v36.17,9.75
D7  (via drill 0.3)
  Top 0.152: UC.1 25.82,26.5 v25.58,26.74 | HL1.8 24.92,5.2 28.09,8.38 31.75,8.38 32.59,9.22 38.38,9.22 39.3,10.13 39.3,10.36 46.23,17.45 46.23,23.24 43.22,26.25 UMBRA.1
  Bottom 0.152: v25.58,26.74 24.89,26.06 24.89,20.27 25.43,19.73 25.43,18.74 24.74,18.06 24.74,14.4 23.83,13.48 23.83,12.95 25.5,11.28 25.5,5.51 HL1.8
D8  (via drill 0.3)
  Top 0.152: UC.28 33.96,24 34.04,24.08 v34.88,24.08
  Bottom 0.152: v34.88,24.08 35.03,24.08 35.72,23.39 35.72,22.63 35.64,22.55 35.64,14.4 35.94,14.09 35.94,11.12 36.71,10.36 36.71,8.38 35.03,6.7 35.03,5 HL2.1
D9  (via drill 0.3)
  Top 0.152: UC.29 34.23,24.5 34.34,24.61 v35.49,24.61
  Bottom 0.152: v35.49,24.61 35.79,24.61 35.94,24.46 35.94,23.62 36.02,23.54 36.02,22.48 35.94,22.4 35.94,14.55 36.25,14.25 36.25,11.28 37.01,10.51 37.01,5.71 37.62,5.1 HL2.2
D10  (via drill 0.3)
  Top 0.152: UC.30 34.64,25 v34.88,25.22
  Bottom 0.152: v34.88,25.22 35.64,25.22 36.25,24.61 36.25,23.77 36.33,23.7 36.33,22.32 36.25,22.25 36.25,14.7 36.55,14.4 36.55,11.43 37.31,10.66 37.31,8.23 40.13,5.41 40.13,5 HL2.3
D11  (via drill 0.3)
  Top 0.152: UC.12 27.5,20.28 27.33,20.11 v27.33,19.5
  Bottom 0.152: v27.33,19.5 26.65,18.82 26.65,18.13 25.96,17.45 25.96,13.79 26.57,13.26 26.57,12.72 25.81,11.96 25.81,6.02 26.19,5.64 26.19,4.34 26.8,3.73 41.48,3.73 HL2.4
D12  (via drill 0.3)
  Top 0.152: UC.26 33.74,23 33.81,23.01 v34.88,23.01 | v35.56,10.28 36.71,10.28 36.93,10.05 v37.85,10.05
  Bottom 0.152: v34.88,23.01 34.88,22.93 35.03,22.78 35.03,14.09 35.33,13.79 35.33,10.51 v35.56,10.28 | v37.85,10.05 40.13,10.05 HL2.5
D13  (via drill 0.3)
  Top 0.152: UC.32 33.98,26 34.42,26.44 v34.42,26.59 | OPAMP.3 13.82,19.67 v14,19.84 | v14,11.58 14.23,11.81 26.95,11.81 28.7,13.56 34.04,13.56 34.5,13.1 35.03,13.1 35.79,13.87 36.33,13.87 37.09,14.63 v37.39,14.63
  Bottom 0.152: v34.42,26.59 35.18,26.59 36.86,24.91 36.86,24.08 36.93,24 36.93,21.94 36.86,21.87 36.86,15.01 37.24,14.63 v37.39,14.63 37.16,14.47 37.16,11.73 37.77,11.12 38.76,11.12 39.52,10.36 40.29,10.36 44.63,6.02 46.71,6.02 HL2.6 | v14,19.84 v14,11.58
D+
  Top 0.152: UC.4 25.95,25 25.73,25.22 24.07,25.22 22.85,24 19.74,24 18.52,25.22 17.73,25.22 17.58,25.07 14.3,25.07 13.54,25.83 11.56,25.83 10.95,25.22 10.95,22.39 R4.2
D-
  Top 0.152: UC.3 25.91,25.5 25.89,25.52 23.91,25.52 22.7,24.3 19.89,24.3 18.67,25.52 17.5,25.52 17.35,25.37 14.46,25.37 13.62,26.21 10.42,26.21 9.83,26.8 R3.2
GND  (via drill 0.3)
  Top 0.152: UC.43 28,26 29.63,24.37 UC.TAB 29,23 29,20.5 | 32,27.5 32,26
  Top 0.254: 26.5,24.5 29.5,24.5 29.63,24.37 | 32,26 30.2,24.2
  Top 0.508: UC.TAB 30.2,24.2
  other vias: 28.93,19.43 25.5,24.61 28.17,29.03 29.24,16.3 30.69,16.3 7.44,22.78 8.82,22.78 8.82,25.07 31.68,28.88 28.07,37.67 14.38,22.74 18.08,24.36 11.25,19.73 17.35,27.66 18.37,30.25 17.46,30.25 6.76,30.53 4.55,32.97 16.06,18.79 18.59,16.11 19.18,18.89 23.45,15.01 14.99,15.04 0.74,35.96 6.68,26.9 5.81,8.47 12.62,16.6 12.17,14.25 0.69,8.63 0.69,15.54 0.69,10.64 0.71,32 6.68,36.5 5.86,10.02 33.28,20.65 23.88,17.44 26.57,15.31 30,18.29 24.06,20.8 33.66,17.52 26.49,11.2 17.12,11.2 15.06,11.2 31.07,38.09 28.76,30.76 26.72,27.81 22.53,30.55 21.01,27.81 18.42,26.13 17.5,21.94 11.71,25.07 12.93,28.27 10.09,29.31 9.81,35.94 33.73,34.13 14.61,35.66 23.04,47.3 29.77,47.3 36.45,47.3 30.86,41.3 21.69,37.94 20.6,41.4 51.72,7.54 44.55,14.75 38.08,20.88 36.88,0.72 23.57,0.73 46.74,0.72 30.25,0.72 16.94,0.72 6.71,0.7 6.43,47.28 53.36,47.31 51.95,38.63 59.36,24 59.29,10.89 59.29,32.43 25.55,42.69 16.74,36.88 36.22,32.36 42.19,28.67 42.42,20.88 26.55,38.3 15.6,9.52 21.06,20.65 24.29,24.61 9.97,33 53.47,0.72 0.76,45.02 31.52,12.95 28.02,12.04 33.81,12.95 34.42,27.73 49.58,40.54 45.7,8.46 40.67,10.89 38.61,8.53 33.05,8.46 39.6,15.01 41.89,17.14 42.12,12.34 38.23,6.17 36.4,6.17 33.66,37.63 24.59,30.63 24.36,27.2 2.69,24.03 0.71,19.04 0.71,28.98 20.75,14.91 19.23,14.53 38.13,16.63 34.11,19.5 3.41,0.7
  pour Top (rank 5): 0,0 60,0 60,48 0,48
  pour Bottom (rank 5): 0,0 60,0 60,48 0,48
MISO  (via drill 0.3)
  Top 0.152: UC.11 v26.65,20.8 | ICSP.1 9.83,12.72 24.59,12.72 25.05,13.18 25.66,13.18 25.89,12.95 v26.04,12.95 26.72,12.95 28.25,14.47 36.02,14.47 37.01,15.47 37.01,20.5 36.63,20.88 36.63,22.7 37.17,23.25 UMBRA.14
  Bottom 0.152: v26.65,20.8 26.65,20.19 26.34,19.89 26.34,18.29 25.66,17.6 25.66,13.33 v26.04,12.95
MOSI  (via drill 0.3)
  Top 0.152: UC.10 26.02,22 25.89,21.87 25.89,21.26 26.04,21.1 v26.04,20.34 | ICSP.5 7.17,15.11 8.1,14.17 8.41,13.87 8.41,11.69 8.74,11.36 8.84,11.36 10.6,11.35 11.66,12.42 25.05,12.42 v25.28,12.65 25.5,12.42 26.65,12.42 28.4,14.17 36.17,14.17 37.31,15.31 37.31,20.65 36.93,21.03 36.93,22.55 37.13,22.75 UMBRA.16
  Bottom 0.152: v26.04,20.34 26.04,18.44 25.35,17.75 25.35,12.72 v25.28,12.65
N$1
  Top 0.152: SK0.1 8.5,45.33 8.82,45.64 9.27,45.64 10.34,46.71 11.38,46.71 SK1.3
N$2
  Top 0.152: UC.17 30,19.36 Y1.2 32.98,16.38 33.54,16.38 C8.1
N$3
  Top 0.152: UC.16 29.5,18.86 Y1.1 27.02,16.38 26.48,16.38 C9.1
N$4
  Top 0.152: SK1.1 15.21,45.33 15.52,45.64 16.05,45.64 17.12,46.71 18.08,46.71 SK2.3
N$5
  Top 0.152: SK2.1 21.91,45.33 22.23,45.64 22.68,45.64 23.75,46.71 24.75,46.71 SK3.3
N$6
  Top 0.152: SK3.1 28.54,45.33 28.86,45.64 29.39,45.64 30.53,46.78 31.49,46.78 SK4.3
N$7
  Top 0.152: UC.36 31.5,28.14 30.91,28.72 30.91,33.04 32.95,35.07 32.95,39.9 35.03,41.98 35.03,43 HL3.1
N$8
  Top 0.152: D13.+ R5.2
N$9
  Top 0.152: SK4.1 35.25,45.33 35.56,45.64 36.02,45.64 37.09,46.71 38.08,46.71 SK5.3
N$10
  Top 0.152: R6.2 57.8,23.26 PWR.+
N$11
  Top 0.152: SK5.1 41.88,45.33 42.19,45.64 42.73,45.64 43.87,46.78 44.86,46.78 SK6.3
N$12
  Top 0.152: SK6.1 48.58,45.33 48.9,45.64 49.43,45.64 50.57,46.78 51.56,46.78 SK7.3
N$13
  Top 0.152: SK9.3 48.61,0.93 49.13,1.45 49.89,1.45 50.8,2.36 51.53,2.36 SK8.1
N$14  (via drill 0.3)
  Top 0.152: R8.2 2.2,11.56 v1.81,11.96 | v3.71,47.01 3.77,47.08 SK0.3
  Bottom 0.152: v1.81,11.96 1.81,15.92 5.92,20.04 5.92,39.24 8.36,41.68 8.36,44.19 7.9,44.65 6,44.65 3.71,46.94 v3.71,47.01
N$15
  Top 0.152: SK10.3 41.9,0.93 42.19,1.22 42.73,1.22 43.87,2.36 44.83,2.36 SK9.1
N$16
  Top 0.152: SK11.3 35.2,0.93 35.56,1.29 36.25,1.29 37.31,2.36 38.13,2.36 SK10.1
N$17
  Top 0.152: SK12.3 28.57,0.93 28.93,1.29 29.7,1.29 30.76,2.36 31.46,2.36 SK11.1
N$18
  Top 0.152: SK13.3 21.86,0.93 22.23,1.29 22.99,1.29 24.06,2.36 24.8,2.36 SK12.1
N$19
  Top 0.152: SK14.3 15.15,0.93 15.52,1.29 16.28,1.29 17.35,2.36 18.13,2.36 SK13.1
N$20
  Top 0.152: SK15.3 8.45,0.93 8.82,1.29 9.58,1.29 10.64,2.36 11.43,2.36 SK14.1
N$21
  Top 0.152: TX.+ R10.2
N$22
  Top 0.152: RX.+ R9.2
N$23  (via drill 0.3)
  Top 0.152: UC.37 31,28.18 30.61,28.57 30.61,33.25 32.64,35.28 32.64,40.05 33.51,40.92 33.51,41.4 v33.71,41.6
  Bottom 0.152: v33.71,41.6 34.01,41.3 35.87,41.3 HL3.2
N$24  (via drill 0.3)
  Top 0.152: UC.38 30.5,28.22 30.3,28.42 30.3,33.4 32.34,35.43 32.34,40.2 32.9,40.76 32.9,41.25 v32.95,41.3
  Bottom 0.152: v32.95,41.3 33.25,40.99 38.1,40.99 HL3.3
N$25  (via drill 0.3)
  Top 0.152: UC.39 30,33.55 31.98,35.53 31.98,40.31 32.18,40.51 v32.18,40.99
  Bottom 0.152: v32.18,40.99 32.49,40.69 40.34,40.69 HL3.4
N$26  (via drill 0.3)
  Top 0.152: UC.40 29.5,28.07 29.7,28.27 29.7,33.91 28.48,35.12 28.48,36.65 31.42,39.6 v31.42,40.69
  Bottom 0.152: v31.42,40.69 31.73,40.38 42.57,40.38 HL3.5
N$27  (via drill 0.3)
  Top 0.152: UC.41 29,28.03 29.39,28.42 29.39,33.75 28.17,34.97 28.17,36.8 30.66,39.29 v30.66,40.38
  Bottom 0.152: v30.66,40.38 30.96,40.08 44.81,40.08 HL3.6
N$28  (via drill 0.3)
  Top 0.152: SK7.1 54.52,45.33 v53.85,44.65 | v56.59,0.91 54.96,0.91 SK8.3
  Bottom 0.152: v53.85,44.65 52.78,44.65 51.56,43.43 51.56,40.84 54.92,37.49 54.92,35.12 56.14,33.91 56.98,33.91 58.8,32.08 58.8,15.01 58.04,14.25 56.06,14.25 54.84,13.03 54.84,9.06 51.56,5.79 51.56,4.34 52.63,3.27 54.23,3.27 v56.59,0.91
N$29
  Bottom 0.152: R2.1 7.86,1.55 PXO.TP
N$30  (via drill 0.35)
  Top 0.152: SK15.1 4.75,2.67 4.08,2 v3,2
  Bottom 0.152: R2.2 5.2,3.1 4.1,2 v3,2
N$34  (via drill 0.3)
  Top 0.152: v11.87,21.68 12.46,21.69 12.64,21.47 OPAMP.1 OPAMP.2 | v10.95,38.94 v21.69,38.94 | v57.36,27.25 57.03,26.92 56.06,26.92 55.73,26.59 55.73,25.43 56.06,25.09 56.67,24.77 R5.1
  Bottom 0.152: v10.95,38.94 11.03,38.94 11.12,38.86 11.64,38.35 11.64,26.52 10.49,25.37 10.49,23.05 v11.87,21.68 | v21.69,38.94 29.54,38.94 29.92,39.32 52.63,39.32 54.61,37.34 54.61,34.97 55.98,33.6 56.82,33.6 58.5,31.93 58.5,28.42 57.58,27.5 57.58,27.48 v57.36,27.25
N$35  (via drill 0.3)
  Top 0.152: Q1.1 21.01,26.89 21.01,26.9 v20.86,26.74 | v18.65,21.18 18.64,21.1 18.65,20.95 18.65,20.8 18.17,20.32 OPAMP.7
  Bottom 0.152: v20.86,26.74 20.86,23.39 v18.65,21.18
PIXELS  (via drill 0.35)
  Top 0.152: R8.1 4.66,10.04 4.7,10 v4.8,10
  Bottom 0.152: EN_PIXELS.2 6.62,8.18 6.34,8.46 6.34,8.69 6.03,9 5.8,9 v4.8,10
RX_LED
  Top 0.152: UC.8 24.89,23 23.37,21.48 19.41,21.48 18.27,22.63 18.27,23.54 18.01,23.8 15.42,23.8 15.19,23.57 15.19,19.51 14.27,18.59 14,18.59 13.21,17.8 11.76,17.8 10.55,19.01 3.25,19.01 RX.-
SCK/PIXELS  (via drill 0.3, 0.35)
  Top 0.152: UC.9 26.06,22.5 25.58,22.02 25.58,21.1 v25.43,20.95 | UMBRA.12 37.22,23.75 36.33,22.86 36.33,20.72 36.71,20.34 36.71,15.62 35.87,14.78 28.09,14.78 26.8,13.48 24.67,13.48 24.44,13.26 v24.36,13.26 23.9,13.26 23.68,13.03 11.76,13.03 ICSP.2 8.54,16.24 6.65,16.24 5.88,15.47 5.88,13.58 v5.2,12.9
  Bottom 0.152: v25.43,20.95 25.43,20.19 25.73,19.89 25.73,18.59 25.05,17.9 25.05,14.17 24.36,13.48 v24.36,13.26 | v5.2,12.9 5.23,12.9 8.04,10.08 12.22,10.08 12.9,9.4 12.9,8.8 12.3,8.2 EN_PIXELS.1
SL0  (via drill 0.3)
  Top 0.152: UMBRA.2 37.47,26.25 v37.47,26.9
  Bottom 0.152: v37.47,26.9 37.47,27.2 37.7,27.43 37.7,27.71 US0.TP
SL1  (via drill 0.3)
  Top 0.152: UMBRA.4 37.24,25.75 36.78,26.21 36.78,27.35 v36.86,27.43
  Bottom 0.152: v36.86,27.43 36.86,28.38 US1.TP
SL2  (via drill 0.3)
  Top 0.152: UMBRA.6 37.28,25.25 36.25,26.29 v36.25,26.9
  Bottom 0.152: v36.25,26.9 36.25,27.42 US2.TP
TX_LED  (via drill 0.3)
  Top 0.152: UC.22 32.5,20.28 34.5,18.29 v34.5,18.21 | v34.72,13.64 34.5,13.87 28.55,13.87 26.8,12.11 11.79,12.11 10.47,10.79 5.66,10.79 5.66,10.86 4.07,12.44 4.07,13.81 3.77,14.11 2.75,14.11 TX.-
  Bottom 0.152: v34.5,18.21 34.72,17.98 v34.72,13.64
UCAP
  Top 0.254: UC.6 24.67,24 23.27,22.6 C12.2
USBD+
  Top 0.254: USB.3 5.24,24 5.46,23.77 5.46,23.39 7.65,21.2 R4.1 8.3,21.2 9.43,22.32 9.43,22.63 9.91,23.11 TVS.1
USBD-
  Top 0.254: USB.2 6.27,24.65 8.24,26.62 R3.1 8.24,26.71 8.82,26.13 8.82,25.98 9.91,24.89 TVS.2
USBGND
  Top 0.356: USB.5 5.39,22.7 7.45,20.65 7.45,20.59 L3.1
VBUS
  Top 0.356: USB.1 6.15,25.3 7.45,26.59 7.45,27.41 L2.1
VCC  (via drill 0.3, 0.33)  (1 unrouted)
  Top 0.152: R1.2 15.83,16.12 | R6.1 56.52,21.74 57.28,20.98 v57.28,20.83 | UMBRA.17 40.74,22.25 v40.59,22.4 | UMBRA.18 39.22,22.25 v39.37,22.4
  Top 0.254: 23.14,18.59 27.71,18.59 28.25,19.12 28.25,19.66 28.5,19.91 UC.14 | C4.2 33.73,30.1 33.66,30.02 33.66,29.58 33.3,29.23 v32.59,28.57 32.5,28.48 UC.34 | L1.1 27.76,33.1 27.89,33.27 27.89,33.8 v27.91,33.95 | UC.2 23.66,26 v23.6,26.06 | C3.2 21.99,19.8 | C16.2 15.62,22.79 15.62,21.01 | OPAMP.8 15.65,20.97 15.62,21.01 | R1.2 14.99,16.86 14.99,18.67 15.6,19.28 15.6,20.24 15.6,21 15.62,21.01 | 15.83,16.12 15.83,15.28 16.54,14.67 D1.C 17.91,14.5 18.57,15.16 v18.57,15.21 19.25,15.21 VR33.3 | R9.1 3.47,17.76 4.7,16.53 v4.7,15.77 4.7,15.16 4.4,14.86 R10.1
  Top 0.305: C1.2 C4.2 | 21.99,19.8 22.46,19.8 v23.14,19.12 | SK0.4 v6.38,45.34 | SK7.4 51.84,45.34 v50.5,45.34 | SK6.4 v43.79,45.34 | SK5.4 v37.09,45.34 | SK4.4 31.77,45.34 v30.46,45.34 | SK3.4 v23.75,45.34 | SK2.4 v17.12,45.34 | SK1.4 v10.42,45.34 | SK15.4 9.49,2.67 v9.5,2.66 | SK13.4 22.83,2.67 v22.84,2.66 | SK12.4 29.53,2.67 v29.54,2.66 | SK11.4 36.16,2.67 v36.17,2.66 | SK10.4 42.79,2.67 v42.8,2.66 | SK9.4 49.5,2.67 v49.51,2.66 | SK8.4 53.71,2.67 v53.7,2.66 | SK14.4 16.12,2.67 v16.13,2.66
  Top 0.508: VR33.3 22.81,15.9 23.14,16.23 23.14,18.59 v23.14,19.12 | C2.2 22.74,25.2 v23.6,26.06 | Q1.2 23.09,28.67 v23.6,29.18
  Top 0.61: VR50.2 21.2,32.6 21.34,32.46 v22.63,32.46 v23.39,32.46 | v23.39,32.46 23.42,32.44 | C14.2 23.14,32.72 v23.39,32.46 | C17.2 24.51,41.22 24.51,43.2 23.75,43.97 v23.75,45.34 | C18.2 33.3,4.14 v33.3,2.69
  Top 0.813: 20.56,32.53 VR50.2
  Top 1.016: VR50.TER 15,32.6 15.08,32.69 v16.85,32.69 v17.61,32.69 v18.37,32.69 18.67,32.69 18.76,32.6 VR50.2 | HL1.9 27.46,5.23 27.48,5.56 29.16,7.24 48.82,7.24 50.27,5.79 50.27,5.71 50.32,5.66 HL2.7
  Bottom 0.152: v57.28,20.83 57.58,20.52 57.74,20.34 58.5,19.58 58.5,15.16 57.89,14.55 55.91,14.55 54.54,13.18 54.54,9.22 52.17,6.86 50.34,6.86 50.27,6.78
  Bottom 0.254: v4.7,15.77 4.7,15.16 5.31,14.55 6.96,12.93 ICSP.6 7.23,11.41 8.21,10.44 15.37,10.44 18.57,13.64 v18.57,15.21
  Bottom 0.508: v23.14,19.12 23.14,25.6 v23.6,26.06 v23.6,29.18 23.6,32.46 v23.39,32.46
  Bottom 0.61: HL4.4 14.76,45.35 | HL2.7 50.12,4.95 | v33.3,2.69 33.33,2.67 34.9,2.67 34.92,2.69
  Bottom 0.813: 50.12,4.95 50.12,2.82 50.19,2.74
  Bottom 1.016: HL4.4 14.76,41.98 15.52,41.22 15.52,36.36 17.35,34.53 17.35,32.84 v17.61,32.69
  Bottom 1.422: 50.27,6.78 50.27,5 HL2.7
  pour Bottom: 16.28,36.19 18.12,34.36 28.2,34.42 28.22,34.42 29.18,33.45 30.63,33.45 32.31,31.78 32.29,31.77 38.31,31.77 41.2,28.88 41.2,17.07 50.8,7.54 50.8,7.01 49.61,7.01 46.63,9.98 45.42,9.98 38.86,16.54 38.78,16.63 38.76,16.68 38.84,27.58 38.84,27.89 37.39,29.33 34.65,29.33 33.28,27.96 32.51,27.96 32.21,28.27 32.21,29.18 30.08,31.32 16.44,31.32 15.67,32.08 15.67,35.58
  pour Bottom: 6.2,45.71 6.05,45.56 6.05,45.1 6.2,44.95 50.65,44.95 50.8,45.1 50.8,45.56 50.65,45.71
  pour Bottom: 9.35,3.1 9.2,2.95 9.2,2.49 9.35,2.34 9.35,2.36 9.37,2.34 53.85,2.34 53.93,2.42 53.93,2.87 53.77,3.03
VCTL  (via drill 0.3)
  Top 0.152: v22.23,20.8 21.85,21.18 19.46,21.18 19.04,20.76 19.04,19.54 18.52,19.02 OPAMP.5 | R12.2 R11.1 23.95,35.09 23.95,30.83 v22.84,29.71
  Bottom 0.152: v22.23,20.8 22.66,21.23 22.66,25.96 23.12,26.41 23.12,28.83 22.84,29.11 v22.84,29.71
VIN
  Top 0.152: R11.2 21.84,35.8 20.92,34.89 VR50.3
  Top 0.508: VR50.3 19.94,34.97 17.2,37.72 11.28,37.72 | D5.2 11.24,34.8 C13.2 11.24,37.68 11.28,37.72 | HL4.2 9.6,42.97 9.6,38.25 10.14,37.72 11.28,37.72
  Top 0.61: 5-12V.1 9.61,35 10.16,34.64 D5.2
VUSB  (via drill 0.3)
  Top 0.254: UC.7 24.78,23.5 23.14,21.87 19.64,21.87 18.88,22.63 v18.88,23.24 | C10.2 14.23,28.19
  Top 0.508: Q1.3 19.01,27.79 v18.88,27.66 17.12,25.91 14.76,25.91 14.23,26.44 C11.2 | 14.23,28.19 C11.2 | L2.2 10.1,28.2 11.56,26.74 14.17,26.74 C11.2
  Bottom 0.254: v18.88,23.24 19.18,23.54 19.18,27.35 v18.88,27.66

### Text on the board
tPlace: Rev. B | CircuitMonkey | Solstice | D E S I G N S Y S T E M | StarFire
bPlace: Solstice | D E S I G N S Y S T E M | Open Source / by CircuitMonkey | StarFire | Rev. B